# EAGLE design UsbOLED (EAGLE 7.7.0)
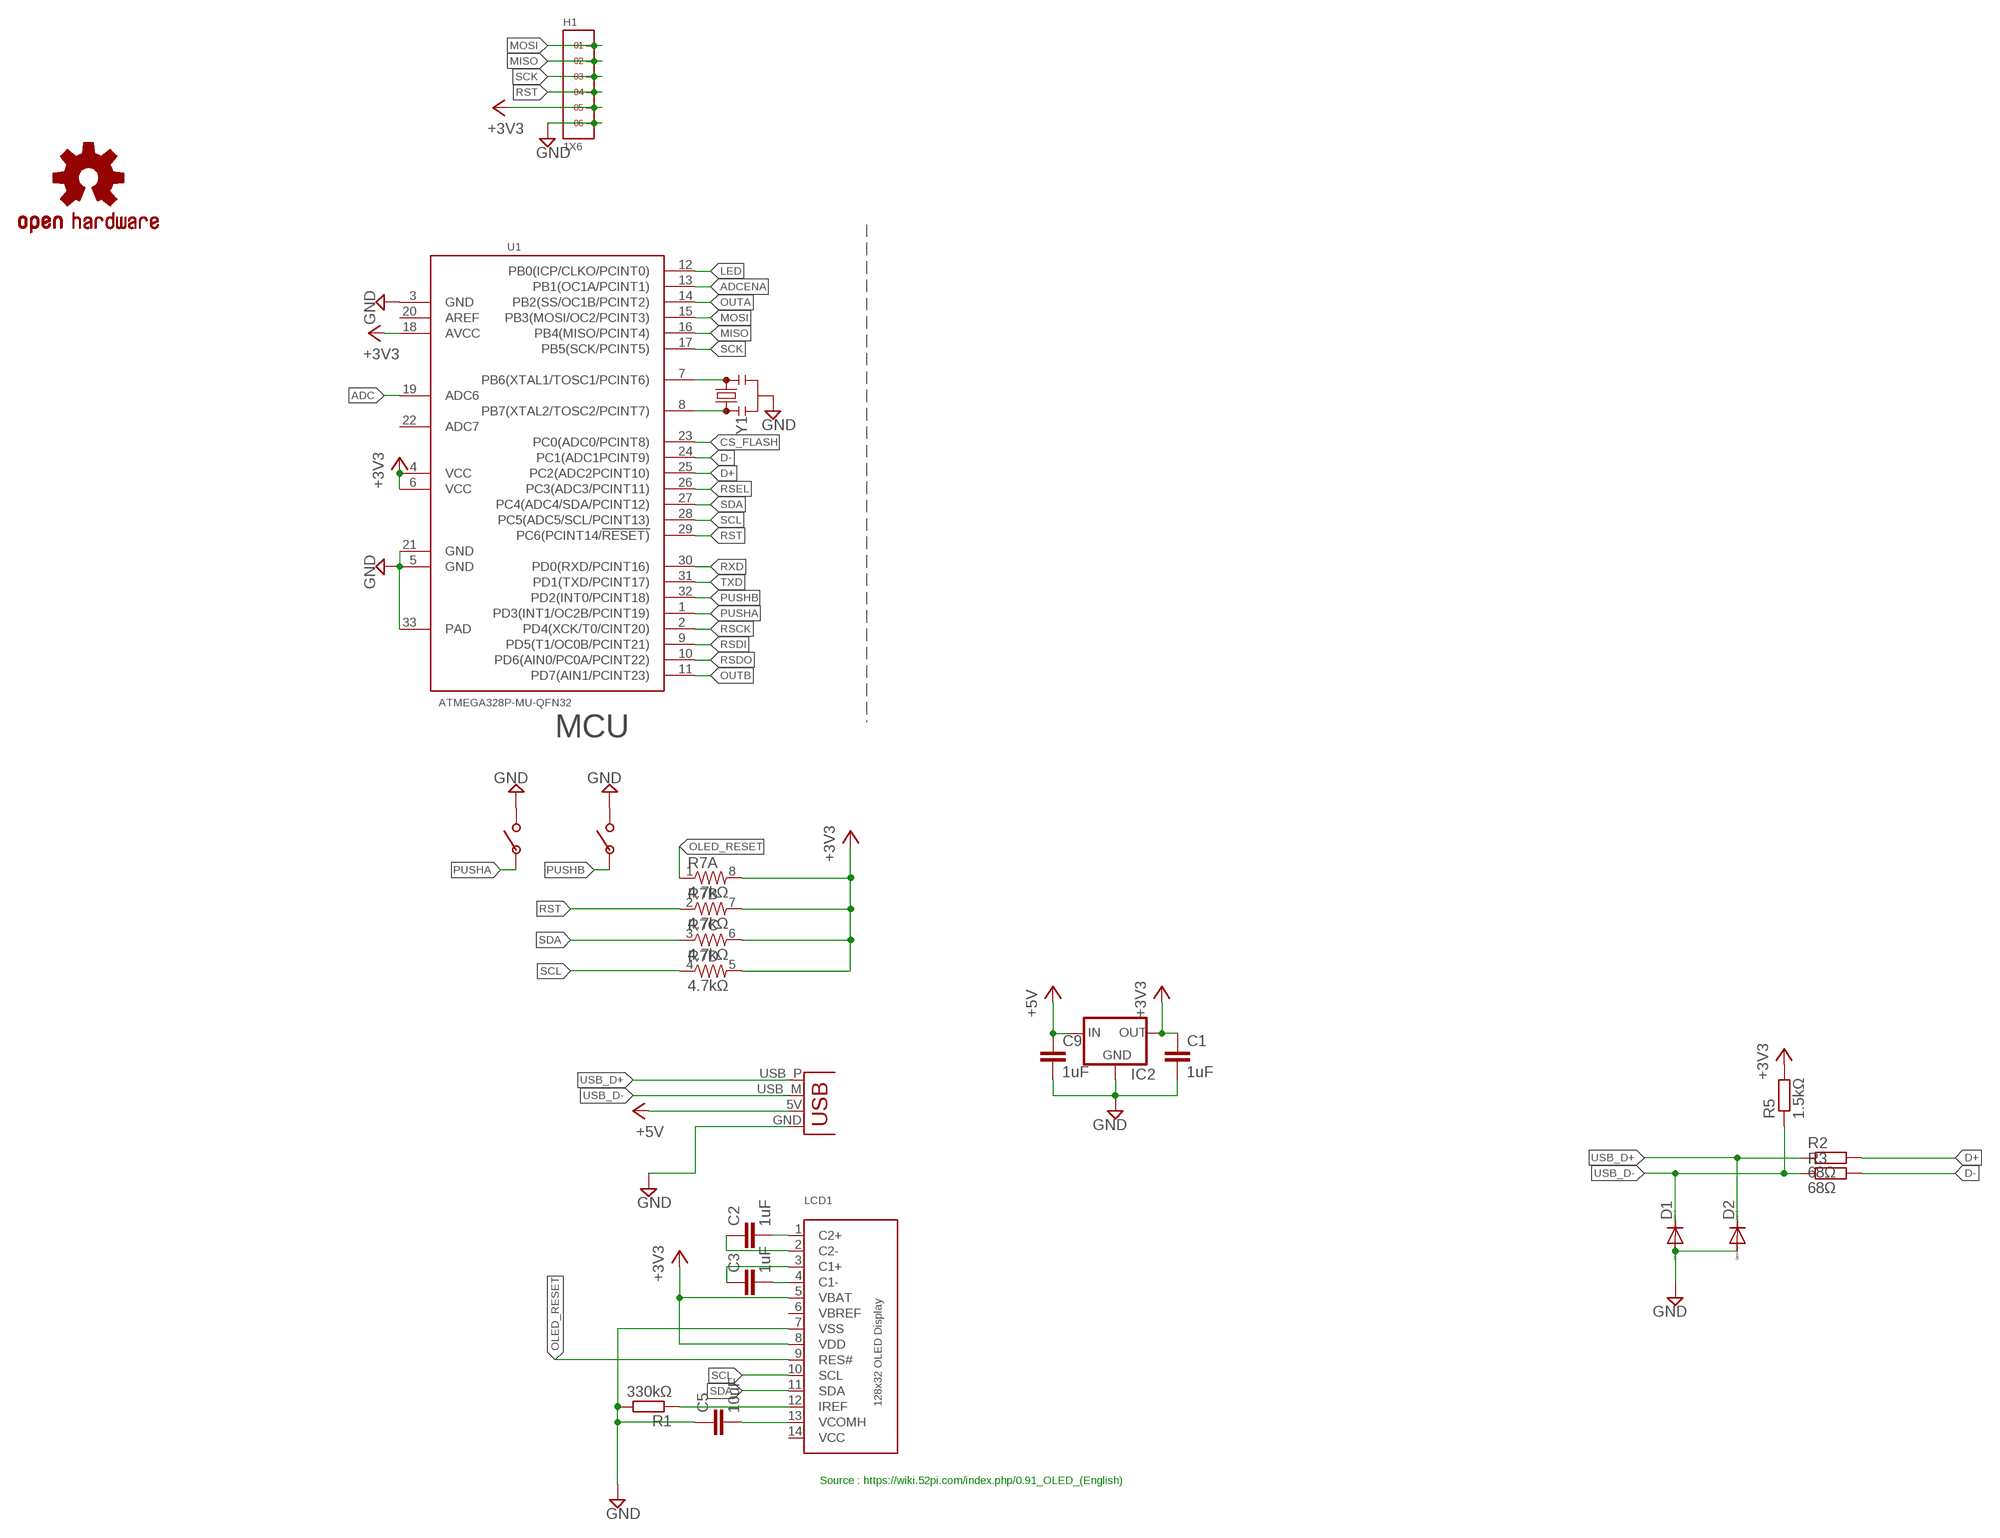
[diagram p0: schematic, sheet 1]

## Parts
C1  1uF  C-EUC0603  [C0603]
C2  1uF  C-EUC0603  [C0603]
C3  1uF  C-EUC0603  [C0603]
C5  10uF  C-EUC0603  [C0603]
C9  1uF  C-EUC0603  [C0603]
D1  DIODE-SOD523  [SOD523]
D2  DIODE-SOD523  [SOD523]
H1  1X6  [1X6]
IC2  MCP1700TT  [SOT-23]
LCD1  DISP_OLED_UG-2832HSWEG02  [UG-2832HSWEG02_WRAPUNDER]
LOGO1  OSHW-LOGOS  [OSHW-LOGO-S]
R1  330kΩ  R-EU_R0603  [R0603]
R2  68Ω  R-EU_R0603  [R0603]
R3  68Ω  R-EU_R0603  [R0603]
R5  1.5kΩ  R-EU_R0603  [R0603]
R7  4.7kΩ  RESISTOR-ARRAY0603-ARV  [0603-ARV]
U1  ATMEGA328P-MU-QFN32  MCU-ATMEGA328P-MU(QFN32)  [QFN32G-0.5-5X5MM]
U$1  PUSHBUTTON_4X2.5  [PUSHBUTTON_4X2.5]
U$3  PUSHBUTTON_4X2.5  [PUSHBUTTON_4X2.5]
X1  USBPCB  [USB-A-PCB]
Y1  RESONATORSMD-3.2X1.3  [RESONATOR-SMD-3.2X1.3]

## Nets
+3V3: C1.1 H1.5 IC2.2(OUT) LCD1.5(VBAT) LCD1.8(VDD) R5.2 R7.5 R7.6 R7.7 R7.8 U1.4(VCC) U1.6(VCC) U1.18(AVCC)
+5V: C9.1 IC2.3(IN) X1.5V(VBUS)
ADC: U1.19(ADC6)
ADCENA: U1.13(PB1(OC1A/PCINT1))
CS_FLASH: U1.23(PC0(ADC0/PCINT8))
D+: R2.2 U1.25(PC2(ADC2PCINT10))
D-: R3.2 U1.24(PC1(ADC1PCINT9))
GND: C1.2 C5.1 C9.2 D1.A D2.A H1.6 IC2.1(GND) LCD1.7(VSS) R1.2 U1.3(GND) U1.5(GND) U1.21(GND) U1.33(PAD) U$1.P$2 U$3.P$2 X1.GND Y1.2
LED: U1.12(PB0(ICP/CLKO/PCINT0))
MISO: H1.2 U1.16(PB4(MISO/PCINT4))
MOSI: H1.1 U1.15(PB3(MOSI/OC2/PCINT3))
N$1: C2.2 LCD1.1(C2+)
N$2: C2.1 LCD1.2(C2-)
N$3: C3.2 LCD1.4(C1-)
N$4: C3.1 LCD1.3(C1+)
N$5: LCD1.12(IREF) R1.1
N$6: U1.7(PB6(XTAL1/TOSC1/PCINT6)) Y1.3
N$7: C5.2 LCD1.13(VCOMH)
N$8: U1.8(PB7(XTAL2/TOSC2/PCINT7)) Y1.1
OLED_RESET: LCD1.9(RES#) R7.1
OUTA: U1.14(PB2(SS/OC1B/PCINT2))
OUTB: U1.11(PD7(AIN1/PCINT23))
PUSHA: U1.1(PD3(INT1/OC2B/PCINT19)) U$1.P$1
PUSHB: U1.32(PD2(INT0/PCINT18)) U$3.P$1
RSCK: U1.2(PD4(XCK/T0/CINT20))
RSDI: U1.9(PD5(T1/OC0B/PCINT21))
RSDO: U1.10(PD6(AIN0/PC0A/PCINT22))
RSEL: U1.26(PC3(ADC3/PCINT11))
RST: H1.4 R7.2 U1.29(PC6(PCINT14/!RESET))
RXD: U1.30(PD0(RXD/PCINT16))
SCK: H1.3 U1.17(PB5(SCK/PCINT5))
SCL: LCD1.10(SCL) R7.4 U1.28(PC5(ADC5/SCL/PCINT13))
SDA: LCD1.11(SDA) R7.3 U1.27(PC4(ADC4/SDA/PCINT12))
TXD: U1.31(PD1(TXD/PCINT17))
USB_D+: D2.C R2.1 X1.USB_P(D+)
USB_D-: D1.C R3.1 R5.1 X1.USB_M(D-)
Unconnected: U1.20(AREF) U1.22(ADC7)

## Notes on the sheet
- MCU
- Source : https://wiki.52pi.com/index.php/0.91_OLED_(English)

## Power pins joined to a net without a drawn wire
VBREF: LCD1.6(VBREF)
VCC: LCD1.14(VCC)

## Library data of the parts
C1-C3 C5 C9 = rcl:C-EU: CAPACITOR, European symbol
D1 D2 = diode:DIODE-: DIODE
H1 = headers(.1in):1X6
IC2 = MCP1700:MCP1700: Microchip MCP1700 positive regulator
LCD1 = microbuilder:DISP_OLED_UG-2832HSWEG02: 128x32 I2C 0.91" Monochrome OLED Display
LOGO1 = Spark:OSHW-LOGO: Open Source Hardware Logo This logo indicates the piece of hardware it is found on incorporates a OSHW license and/or adheres to the definition of open source hardware found here: http://freedomdefined.org/OSHW
R1-R3 R5 = rcl:R-EU_: RESISTOR, European symbol
R7 = SparkFun:RESISTOR-ARRAY: Array Chip Resistor Source: RS Component / Phycomp
U1 = Seeed-OPL-ic:MCU-ATMEGA328P-MU(QFN32): 310010005; MPN: ATMEGA328P-MU
U$1 U$3 = pusbbutton_4x2_5:PUSHBUTTON_4X2.5
X1 = SparkFun:USB: USB Connectors USB-B-PTH is fully proven SKU : PRT-00139 USB-miniB is fully proven SKU : PRT-00587 USB-A-PCB is untested. USB-A-H is throughly reviewed, but untested. Spark Fun Electronics SKU : PRT-00437 USB-B-SMT is throughly reviewed, but untested. Needs silkscreen touching up. USB-A-S has not been used/tested USB-MB-H has not been used/tested
Y1 = SparkFun-Clocks:RESONATOR: Resonators (Generic) Ceramic resonators are clock-generating components, often used to control timing in microcontrollers. They usually have 3 pins: two pins for oscillation, and one pin for ground. Compared to crystals, resonators have worse tolerance, but are usually much cheaper. Plus, they have built-in load capacitors! These devices are used on boards like the Arduino Pro 8MHz <https://www.sparkfun.com/products/11114> and Arduino Pro 16MHz <https://www.sparkfun.com/products/11113>.

## Board
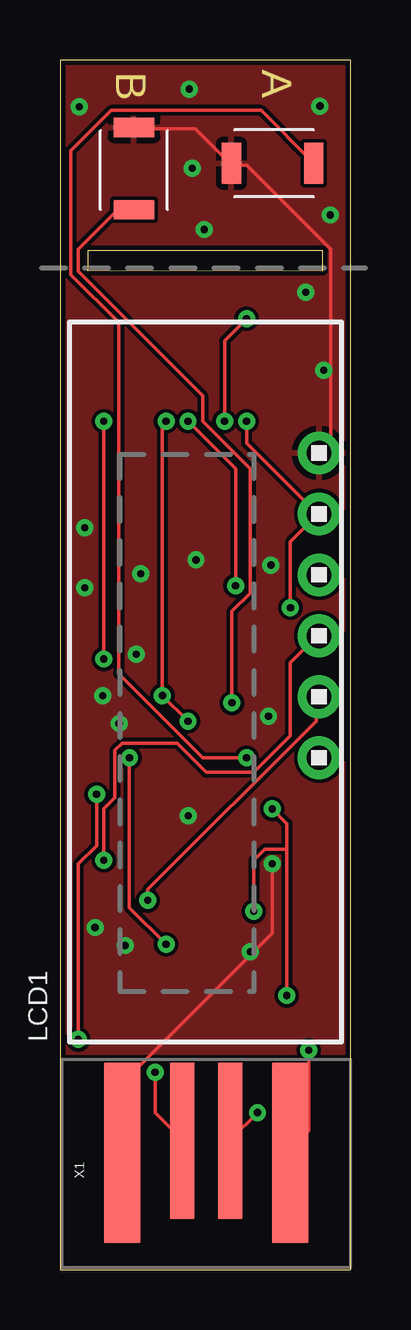
[diagram p1: board, top side]
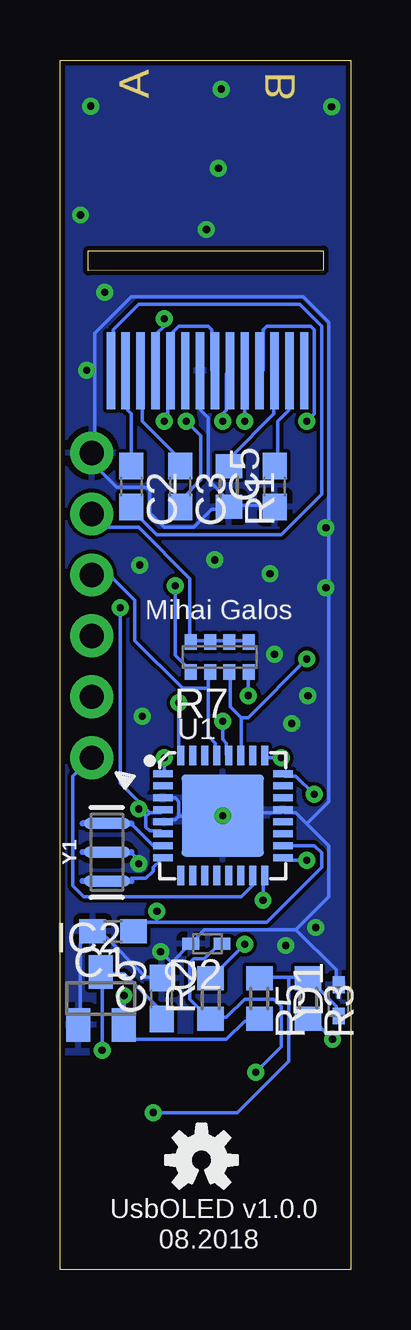
[diagram p2: board, bottom side, seen from below]

Size 12.12 x 50.41 mm. Coordinates in mm from the lower left corner, seen from the top.
Outline: 1.14,41.65 10.95,41.64 10.95,42.45 1.15,42.47 1.15,41.66
Outline: 0,0 12.12,0 12.12,50.41 0,50.41 0,0
Copper layers (1*16): Top 0.035mm / dielectric 1.5mm / Bottom 0.035mm
Design rules "default": minimum track width 6mil, minimum drill 0.3mm, track to track 6mil, track to pad 6mil, pad to pad 6mil, via to via 6mil, smd to smd 6mil, copper to edge 8mil, drill to drill 8mil, minimum pad ring 10mil, minimum via ring 8mil, stop-mask expansion 4mil, vias tented up to drill 0mil, thermal gap 10mil

### Footprints (pad centres in the part's own frame; a part is rotated, then mirrored left to right if it is on the bottom)
C0603 = smd 1.1 x 1: 1 -0.85,0; 2 0.85,0
SOD523 = smd 0.7 x 0.5: A 0.7,0; C -0.6,0
1X6 = drill 1.016 pad 1.778: 1 0,0; 2 2.54,0; 3 5.08,0; 4 7.62,0; 5 10.16,0; 6 12.7,0
SOT-23 = smd 1 x 1.4: 1 -0.95,-1.1; 2 0.95,-1.1; 3 0,1.1
UG-2832HSWEG02_WRAPUNDER = smd 3.2 x 0.35 bottom: 1 -2.03,-4.03; 2 -2.03,-3.41; 3 -2.03,-2.79; 4 -2.03,-2.17; 5 -2.03,-1.55; 6 -2.03,-0.93; 7 -2.03,-0.31; 8 -2.03,0.31; 9 -2.03,0.93; 10 -2.03,1.55; 11 -2.03,2.17; 12 -2.03,2.79; 13 -2.03,3.41; 14 -2.03,4.03
R0603 = smd 1 x 1.1: 1 -0.85,0; 2 0.85,0
0603-ARV = smd 0.5 x 0.65: 1 -1.2,-0.625; 2 -0.4,-0.625; 3 0.4,-0.625; 4 1.2,-0.625; 5 1.2,0.625; 6 0.4,0.625; 7 -0.4,0.625; 8 -1.2,0.625
QFN32G-0.5-5X5MM = smd 0.813 x 0.279: 1 -2.5,1.75; 2 -2.5,1.25; 3 -2.5,0.75; 4 -2.5,0.25; 5 -2.5,-0.25; 6 -2.5,-0.75; 7 -2.5,-1.25; 8 -2.5,-1.75; 17 2.5,-1.75; 18 2.5,-1.25; 19 2.5,-0.75; 20 2.5,-0.25; 21 2.5,0.25; 22 2.5,0.75; 23 2.5,1.25; 24 2.5,1.75 | smd 0.279 x 0.813: 9 -1.75,-2.5; 10 -1.25,-2.5; 11 -0.75,-2.5; 12 -0.25,-2.5; 13 0.25,-2.5; 14 0.75,-2.5; 15 1.25,-2.5; 16 1.75,-2.5; 25 1.75,2.5; 26 1.25,2.5; 27 0.75,2.5; 28 0.25,2.5; 29 -0.25,2.5; 30 -0.75,2.5; 31 -1.25,2.5; 32 -1.75,2.5 | smd 3.429 x 3.429: 33 0,0
PUSHBUTTON_4X2.5 = smd 0.8 x 1.7: P$1 -1.27,0; P$2 2.159,0
USB-A-PCB = smd 7.5 x 1.5: 5V -0.2,-3.5; GND -0.2,3.5 | smd 6.5 x 1: USB_M 0.3,-1; USB_P 0.3,1
RESONATOR-SMD-3.2X1.3 = smd 0.45 x 1.905: 1 -1.2,0; 2 0,0; 3 1.2,0

### Placement (x,y rotation side)
C1  9.91,14.1 180 bottom
C2  9.14,32.64 270 bottom
C3  7.11,32.64 270 bottom
C5  3.17,32.64 90 bottom
C9  7.87,11.3 90 bottom
D1  0.51,11.18 90 bottom
D2  5.97,13.59 180 bottom
H1  10.79,21.34 90 top
IC2  10.41,11.3 0 bottom
LCD1  5.97,39.5 90 top
LOGO1  6.22,4.57 0 bottom
R1  5.08,32.64 270 bottom
R2  5.84,11.3 90 bottom
R3  1.78,11.3 270 bottom
R5  3.81,11.3 270 bottom
R7  5.46,25.53 0 bottom
U1  5.33,18.92 0 bottom
U$1  9.3,46.1 180 top
U$3  3.08,45.44 90 top
X1  6.1,5.08 90 top
Y1  10.16,17.4 90 bottom

### Tracks (layer width: path | path; a pad name or v marks a point on that pad's centre or on a via)
+3V3  (via drill 0.3)
  Top 0.152: v9.6,27.58 9.6,30.33 10.67,31.39 H1.5 10.67,31.55 7.77,34.44 v7.77,35.36 | 9.45,17.53 9.45,18.59 v8.84,19.2 | 9.45,17.53 v9.45,11.43 | v8.08,14.94 8.08,17.07 8.53,17.53 9.45,17.53
  Bottom 0.152: 8.08,14.48 8.69,14.48 8.99,14.17 C1.1 | 8.08,14.48 3.5,14.48 1.22,16.76 1.22,17.37 1.52,17.68 2.74,17.68 U1.18 | LCD1.8 5.79,37.49 5.79,39.17 5.94,39.32 7.16,39.32 7.47,39.01 7.47,37.49 LCD1.5 7.62,37.34 7.62,35.51 v7.77,35.36 | R5.2 3.81,10.36 4.42,10.36 5.18,9.6 8.99,9.6 9.45,10.06 IC2.2 9.45,10.21 v9.45,11.43 | R7.5 4.27,26.21 5.03,26.21 R7.6 5.18,26.21 5.79,26.21 R7.7 5.94,26.21 6.55,26.21 R7.8 6.71,26.21 6.71,28.8 8.84,30.94 10.21,30.94 10.67,31.39 H1.5 | 8.38,19.05 8.53,18.9 8.53,18.44 8.38,18.29 7.92,18.29 U1.6 | 8.38,19.05 7.92,19.05 U1.4 | 8.69,19.36 9.6,20.27 v9.6,27.58 | 8.69,19.36 8.38,19.05 | 8.69,19.36 v8.84,19.2 | v8.08,14.94 8.08,14.48
+5V  (via drill 0.3)
  Top 0.152: v10.36,9.14 10.36,5.79 9.6,5.03 X1.5V
  Bottom 0.152: 10.36,12.34 9.45,12.34 7.92,10.82 7.92,10.52 C9.1 | v10.36,9.14 10.36,12.34 | 10.36,12.34 IC2.3
D+  (via drill 0.3)
  Top 0.152: v2.9,21.34 2.9,15.09 v4.42,13.56
  Bottom 0.152: v2.9,21.34 3.5,21.34 U1.25 | v4.42,13.56 5.79,12.19 R2.2
D-  (via drill 0.3)
  Top 0.152: v1.52,19.81 1.52,17.68 0.76,16.92 v0.76,9.6
  Bottom 0.152: v1.52,19.81 2.29,20.57 2.74,20.57 U1.24 | v0.76,9.6 1.68,10.52 R3.2
GND  (via drill 0.3)
  Top 0.152: U$3.P$2 3.2,47.55 5.64,47.55 7.01,46.18 U$1.P$2 7.16,46.02 7.77,46.02 11.28,42.52 11.28,34.59 10.82,34.14 H1.6 | v8.84,16.92 8.84,14.02 8.08,13.26 | 8.08,13.26 2.74,7.92 2.74,5.03 X1.GND | 8.08,13.26 v7.92,13.26
  Bottom 0.152: C5.1 3.2,31.85 5.03,31.85 R1.2 | R1.2 5.18,31.85 5.18,32.16 5.94,32.92 5.94,35.51 6.25,35.81 6.25,37.34 LCD1.7 | R1.2 5.18,31.7 5.79,31.7 6.55,30.94 7.77,30.94 8.38,31.55 8.38,32.46 8.53,32.61 9.75,32.61 10.67,33.53 10.67,33.98 H1.6 10.67,34.14 10.67,39.01 9.14,40.54 1.98,40.54 0.91,39.47 0.91,19.51 1.83,18.59 | 7.16,18.9 7.32,18.75 7.77,18.75 U1.5 | 7.16,18.9 7.16,19.51 7.32,19.66 7.77,19.66 U1.3 | 7.16,18.9 5.33,18.9 U1.33 5.33,19.05 2.9,19.05 U1.21 2.74,19.05 2.29,19.05 1.83,18.59 | 2.29,14.17 0.61,12.5 0.61,11.89 D1.A | 2.29,14.17 6.1,14.17 6.55,13.72 D2.A 6.71,13.56 7.47,12.8 | 7.47,12.8 7.77,12.5 7.77,12.19 C9.2 7.92,12.19 8.53,12.19 10.36,14.02 10.67,14.02 C1.2 10.82,14.02 11.28,13.56 11.28,10.21 IC2.1 | 1.83,18.59 0.91,17.68 0.91,15.54 2.29,14.17 | v8.84,16.92 8.84,17.07 9.14,17.37 9.14,17.4 | v7.92,13.26 7.47,12.8
  other vias: 8.69,23.07 2.46,22.76 1.78,23.91 3.18,25.65 3.37,29 5.67,29.58 8.79,29.36 6.01,43.35 5.39,49.2 0.8,48.45 10.83,48.49 11.26,43.95 10.25,40.73 1.46,14.26 2.71,13.51 1.03,28.41 1.03,30.91 11,37.48 5.34,18.92 5.51,45.9
  pour Top: 0.25,9 12.25,9 12,50.5 0,50.5
  pour Bottom: 0,9 12,9 12,50.5 0,50.5
MISO  (via drill 0.3)
  Top 0.152: v3.66,15.39 3.66,15.85 10.67,22.86 10.67,23.77 H1.2
  Bottom 0.152: v3.66,15.39 3.66,16.31 U1.16
MOSI
  Bottom 0.152: U1.15 4.12,16.31 4.12,16 4.57,15.54 11.12,15.54 11.58,16 11.58,20.57 10.82,21.34 H1.1
N$1
  Bottom 0.152: C2.2 9.14,31.7 8.08,30.63 2.9,30.63 1.22,32.31 1.22,39.32 2.13,40.23 8.84,40.23 9.91,39.17 9.91,37.49 LCD1.1
N$2
  Bottom 0.152: C2.1 9.14,35.66 9.3,35.81 9.3,37.34 LCD1.2
N$3  (via drill 0.3)
  Top 0.152: v6.86,35.36 6.86,38.71 v7.77,39.62
  Bottom 0.152: v6.86,35.36 6.25,34.75 6.25,32.92 7.01,32.16 7.01,31.85 C3.2 | v7.77,39.62 7.77,39.32 8.08,39.01 8.08,37.49 LCD1.4
N$4
  Bottom 0.152: C3.1 7.16,33.53 7.16,33.83 8.69,35.36 8.69,37.34 LCD1.3
N$5
  Bottom 0.152: R1.1 5.03,33.53 5.03,33.83 3.2,35.66 3.2,37.34 LCD1.12
N$6
  Bottom 0.152: U1.7 7.92,17.68 8.23,17.68 9.14,18.59 9.14,18.6
N$7
  Bottom 0.152: C5.2 3.05,33.53 3.05,35.36 2.59,35.81 2.59,37.34 LCD1.13
N$8
  Bottom 0.152: U1.8 7.92,17.07 8.23,16.76 8.23,16.61 8.53,16.31 9.14,16.31 9.14,16.2
OLED_RESET  (via drill 0.3)
  Top 0.152: v7.32,28.5 7.32,33.38 v5.33,35.36
  Bottom 0.152: v7.32,28.5 7.32,25.6 6.71,24.99 R7.1 | v5.33,35.36 5.33,35.66 5.18,35.81 5.18,37.34 LCD1.9
PUSHA  (via drill 0.3)
  Top 0.152: v7.77,21.34 5.94,21.34 2.44,24.84 2.44,39.47 0.46,41.45 0.46,46.63 2.13,48.31 8.38,48.31 10.52,46.18 U$1.P$1
  Bottom 0.152: v7.77,21.34 7.77,20.73 U1.1
PUSHB  (via drill 0.3)
  Top 0.152: v7.16,23.62 7.16,27.43 7.92,28.19 7.92,33.38 5.94,35.36 5.94,36.42 0.76,41.6 0.76,42.52 2.29,44.04 3.05,44.04 U$3.P$1
  Bottom 0.152: v7.16,23.62 7.16,21.49 U1.32
RST
  Bottom 0.152: 5.94,24.23 5.94,22.25 5.64,21.95 5.64,21.49 U1.29 | 5.94,24.23 5.94,24.84 R7.2 | 5.94,24.23 7.01,24.23 8.99,26.21 8.99,27.89 10.06,28.96 H1.4
SCK  (via drill 0.3)
  Top 0.152: v1.83,17.07 1.83,19.2 2.29,19.66 2.29,21.64 2.59,21.95 4.88,21.95 6.1,20.73 8.08,20.73 9.6,22.25 9.6,25.3 10.67,26.36 H1.3
  Bottom 0.152: v1.83,17.07 2.74,17.07 U1.17
SCL  (via drill 0.3)
  Top 0.152: v5.33,22.86 v4.27,23.93 4.27,35.2 v4.42,35.36
  Bottom 0.152: v4.27,23.93 4.27,24.84 R7.4 | v5.33,22.86 5.33,22.1 5.18,21.95 5.18,21.49 U1.28 | v4.42,35.36 4.42,37.34 LCD1.10
SDA  (via drill 0.3)
  Top 0.152: v1.83,35.36 v1.83,25.45
  Bottom 0.152: 4.57,23.01 5.03,23.47 5.03,24.84 R7.3 | 4.57,23.01 4.57,21.49 U1.27 | 4.57,23.01 4.27,23.01 v1.83,25.45 | v1.83,35.36 1.52,35.66 1.52,39.17 1.68,39.32 3.5,39.32 3.66,39.17 3.66,37.49 LCD1.11
USB_D+  (via drill 0.3)
  Top 0.152: v3.96,8.23 3.96,6.55 5.03,5.49 X1.USB_P
  Bottom 0.152: D2.C 5.49,13.56 6.1,12.95 6.55,12.95 6.71,12.8 6.71,11.28 5.94,10.52 R2.1 5.79,10.52 5.18,10.52 4.42,11.28 3.2,11.28 2.9,10.97 2.9,9.3 v3.96,8.23
USB_D-  (via drill 0.3)
  Top 0.152: v8.23,6.55 7.16,5.49 X1.USB_M
  Bottom 0.152: D1.C 0.61,10.67 0.61,10.97 1.68,12.04 R3.1 1.83,12.19 2.59,12.19 | 2.59,12.19 3.81,12.19 R5.1 | 2.59,12.19 2.59,8.69 4.72,6.55 v8.23,6.55

### Text on the board
Dimension: B | A
bPlace: Mihai Galos | UsbOLED v1.0.0 | 08.2018